# Altium schematic sheet Stepper_control.SchDoc: Stepper Control
size A3; DrawnBy: Mogens Groth Nicolaisen; DocumentNumber: 4; SheetNumber: 4; SheetTotal: 7
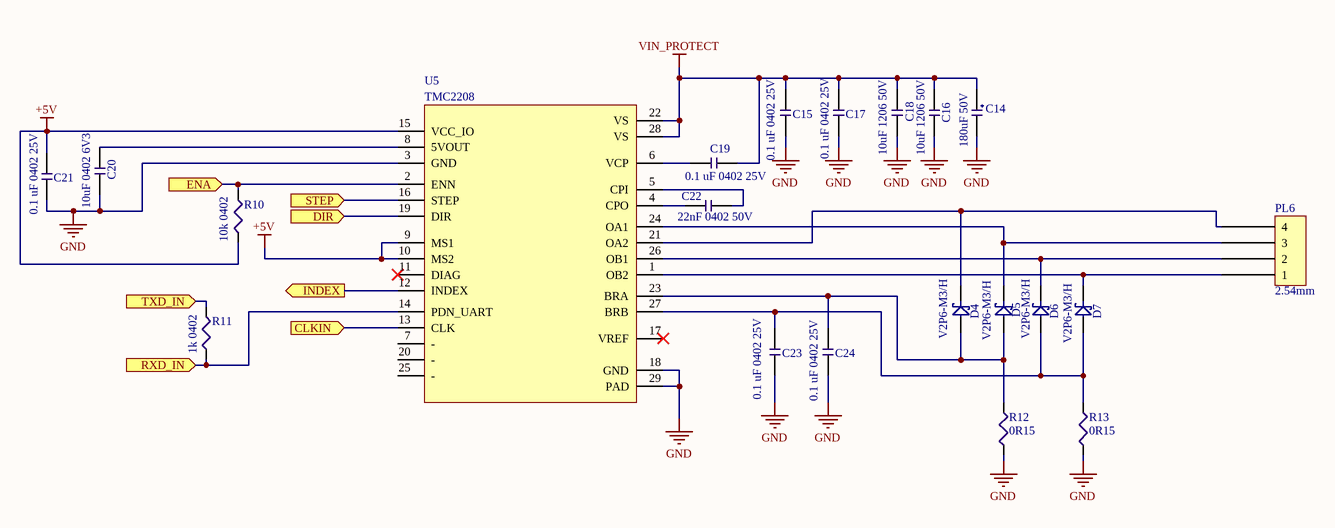
[diagram p0: Stepper_control.SchDoc]

## Parts
C14  180uF 50V  [Capacitor 8x22]
C15  0.1 uF 0402 25V  [CAP_0402]
C16  10uF 1206 50V  [CAP_1206]
C17  0.1 uF 0402 25V  [CAP_0402]
C18  10uF 1206 50V  [CAP_1206]
C19  0.1 uF 0402 25V  [CAP_0402]
C20  10uF 0402 6V3  [CAP_0402]
C21  0.1 uF 0402 25V  [CAP_0402]
C22  22nF 0402 50V  [CAP_0402]
C23  0.1 uF 0402 25V  [CAP_0402]
C24  0.1 uF 0402 25V  [CAP_0402]
D4  V2P6-M3/H  [MicroSMP]
D5  V2P6-M3/H  [MicroSMP]
D6  V2P6-M3/H  [MicroSMP]
D7  V2P6-M3/H  [MicroSMP]
PL6  2.54mm  [4-pin 2.54mm header]
R10  10k 0402  [RES_0402]
R11  1k 0402  [RES_0402]
R12  0R15  [RES_1206]
R13  0R15  [RES_1206]
U5  TMC2208  [QFN50P500X500X90_HS-29N]

## Ports
CLKIN (in), DIR (in), ENA (in), INDEX (out), RXD_IN (in), STEP (in), TXD_IN (in)

## Nets
+5V: C21.2 R10.2 U5.9(MS1) U5.10(MS2) U5.15(VCC_IO)
GND: C14.2 C15.1 C16.2 C17.1 C18.2 C20.1 C21.1 C23.1 C24.1 R12.1 R13.1 U5.3(GND) U5.18(GND) U5.29(PAD)
VIN_PROTECT: C14.1 C15.2 C16.1 C17.2 C18.1 C19.1 U5.22(VS) U5.28(VS)
CLKIN: U5.13(CLK) ; port CLKIN
DIR: U5.19(DIR) ; port DIR
ENA: R10.1 U5.2(ENN) ; port ENA
INDEX: U5.12(INDEX) ; port INDEX
RXD_IN: R11.1 U5.14(PDN_UART) ; port RXD_IN
STEP: U5.16(STEP) ; port STEP
TXD_IN: R11.2 ; port TXD_IN
NetC19_2: C19.2 U5.6(VCP)
NetC20_2: C20.2 U5.8(5VOUT)
NetC22_1: C22.1 U5.4(CPO)
NetC22_2: C22.2 U5.5(CPI)
NetC23_2: C23.2 D6.1 D7.1 R13.2 U5.27(BRB)
NetC24_2: C24.2 D4.1 D5.1 R12.2 U5.23(BRA)
NetD4_2: D4.2 PL6.4 U5.21(OA2)
NetD5_2: D5.2 PL6.3 U5.24(OA1)
NetD6_2: D6.2 PL6.2 U5.26(OB1)
NetD7_2: D7.2 PL6.1 U5.1(OB2)

Not connected (* = marked no-connect by the designer): U5 7(-) 11(DIAG)* 17(VREF)* 20(-) 25(-)

## Notes on the sheet
- ON Development
- Title:
- Size:
- A3
- Drawn By:
- Date:
- Sheet
- of
- Revision:

## Library data of the parts
C14 = CMP-002-0003-2: 180UF 20% 50V 105DEG RADIAL; Tolerance: 20%; Value: 180uF; Case/Package: -
C15 C17 C19 C21 C23 C24 = CMP-00061-4: 0.1UF 25V 10% X5R 0402; Mfg. Part Number: TMK105BJ104KV-F; Tolerance: 10%; Value: 0.1 uF; Voltage: 25V
C16 C18 = CMP-00030-4: 10uF 1206 50V X5R 20%; Tolerance: +/- 20%; Value: 10uF; Voltage: 50 V
C20 = CMP-00011-3: 10uF 20% 0402 6V3 X6S; Current Rating: -; Tolerance: 20%; Value: 10uF; Voltage: 6V3
C22 = CMP-00045-4: 22nF 0402 50V X7R 10%; Mfg. Part Number: 885012205063; Tolerance: 10%; Value: 22nF; Voltage: 50V
D4-D7 = CMP-016-0002-2: DIODE SCHOTTKY 60V 2A MICROSMP
PL6 = CMP-003-0003-3: Pin header 4-pin 2.54mm male; Mfg. Part Number: DS1021-1*4SF1-1
R10 = CMP-001-0019-3: RES SMD 10K OHM 1% 1/16W 0402; Mfg. Part Number: RMCF0402FT10K0; Case/Package: 0402; Power: 1/16 W; Tolerance: 1 %; Value: 10k
R11 = CMP-001-0025-3: RES SMD 1K OHM 1% 1/16W 0402; Mfg. Part Number: CRG0402F1K0; Case/Package: 0402; Power: 1/16W; Tolerance: 1%; Value: 1k
R12 R13 = CMP-001-0039-2: RES 0.15 OHM 1% 1/2W 1206; Mfg. Part Number: RL1206FR-7W0R15L; Power: 0.5W; FootprintName1: RES_1206; FootprintDescription1: Chip Resistor, 2-Leads, 1206, IPC Medium Density; FootprintRevisionID1: RES_1206-1; Tolerance: 1%; Value: 0R15; Case/Package: 1206
U5 = CMP-00063-3: IC STEPPER MOTOR DRIVER 28QFN; Mfg. Part Number: TMC2208-LA-T